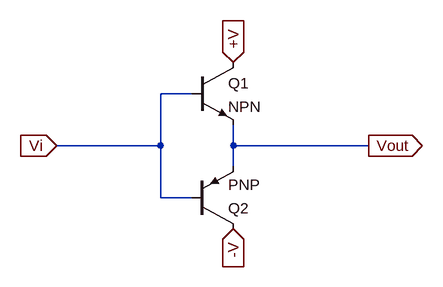
[diagram p0: schematic poweramp.asc]
poweramp.asc, the LTspice schematic file:
Version 4
SHEET 1 912 760
WIRE 528 80 480 80
WIRE 480 160 480 80
WIRE 480 160 320 160
WIRE 592 160 592 128
WIRE 800 160 592 160
WIRE 592 192 592 160
WIRE 480 240 480 160
WIRE 528 240 480 240
FLAG 320 160 Vi
IOPIN 320 160 In
FLAG 592 32 +V
IOPIN 592 32 In
FLAG 800 160 Vout
IOPIN 800 160 Out
FLAG 592 288 -V
IOPIN 592 288 In
SYMBOL npn 528 32 R0
SYMATTR InstName Q1
SYMBOL pnp 528 288 M180
SYMATTR InstName Q2

The netlist it stands for:
* poweramp.asc
Q1 +V Vi Vout 0 NPN
Q2 -V Vi Vout 0 PNP
.model NPN NPN
.model PNP PNP
.lib standard.bjt
.backanno
.end